# Altium schematic sheet SolBout.SchDoc: Soldeerbout Out
size A4; DrawnBy: Mangelschots Emiel; SheetNumber: 3; SheetTotal: 5; Parameter 1: /; Parameter 2: 1EAID 12302093
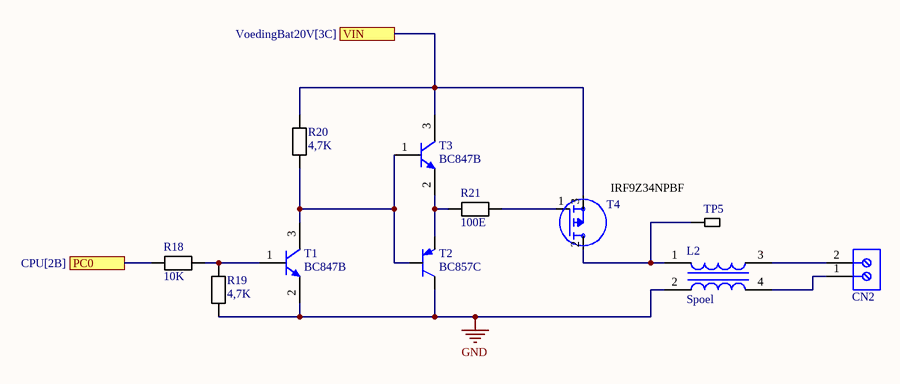
[diagram p0: SolBout.SchDoc]

## Parts
CN2  1725656  [2 pinHeader]  (value not drawn)
L2  Spoel  [Spoel]
R18  10K  [REST]
R19  4,7K  [REST]
R20  4,7K  [REST]
R21  100E  [REST]
T1  BC847B  [TRANS]
T2  BC857C  [SOT95P240X120-3N]
T3  BC847B  [TRANS]
T4  MOSFET  [TO254P1041X444X1930-3]  (value not drawn)
TP5  TP  [TP]  (value not drawn)

## Ports
PC0 (see CPU[2B]), VIN (see VoedingBat20V[3C])

## Nets
GND: L2.2 R19.1 T1.2(E) T2.3(C)
PC0: R18.1 ; port PC0
VIN: R20.2 T3.3(C) T4.3(S) ; port VIN
NetCN2_1: CN2.1 L2.4
NetCN2_2: CN2.2 L2.3
NetL2_1: L2.1 T4.2(D) TP5.1
NetR18_2: R18.2 R19.2 T1.1(B)
NetR20_1: R20.1 T1.3(C) T2.1(B) T3.1(B)
NetR21_1: R21.1 T2.2(E) T3.2(E)
NetR21_2: R21.2 T4.1(G)

## Notes on the sheet
- IRF9Z34NPBF

## Library data of the parts
CN2 = 2Pin-Header: Manufacturer: Phoenix Contact; Number of contacts: 2; Content: 250pc(s); Pitch: 2.54mm; Industrial packaging: Yes; Colour: Green; Manufacturer part No.: 1725656; Type: MPT0,5/2-2,54; Datasheet URL: http://datasheet.octopart.com/1725656-Phoenix-Contact-datasheet-5302866.pdf; Manufacturer URL: http://www.phoenixcontact.com/; Datasheet Version: Apr-08
L2 = Spoel: 2 Line Common Mode Choke Through Hole 170 Ohms @ 100 MHz 10A DCR 10mOhm CM2545X171B-10; MF: Laird; Value: *; Purchase-URL: https://pricing.snapeda.com/search/part/CM2545X171B-10/?ref=eda; Price: None; Package: Vertical-4 Laird; SnapEDA_Link: https://www.snapeda.com/parts/CM2545X171B-10/Laird/view-part/?ref=snap; Availability: In Stock; Check_prices: https://www.snapeda.com/parts/CM2545X171B-10/Laird/view-part/?ref=eda; MP: CM2545X171B-10
R18-R21 = resistor: Manufacturer: Vishay Dale; Part Number: CRCW08050000Z0EA
T1 T3 = Transistor: Manufacturer: On Semiconductor; PartNumber: BC547C; IC Continuous (A): 0.1; fT Min (MHz): 150; Packing: Bulk Box; Polarity: NPN; Mounting Technology: Through Hole; ComponentLink1URL: http://www.onsemi.com/; ComponentLink1Description: Manufacturer URL; ComponentLink3URL: http://www.onsemi.cn/pub_link/Collateral/2N6426-D.PDF; DatasheetVersion: Rev. 7; PackageVersion: Rev. AM; RoHS: FALSE; ComponentLink2URL: http://www.onsemi.com/pub_link/Collateral/BC546-D.PDF; ComponentLink3Description: Package Specification; PackageDescription: 3-Pin Transistor Outline, Body 4.825 x 3.685 mm, Pitch 1.27 mm; PackageReference: TO-92-3-29-11_AM_SL; ComponentLink2Description: Datasheet
T2 = BC857B: BJT, SOT-23, 45V, 100mA, PNP, 0.25W, 150C; MF: Diotec; SnapEDA_Link: https://www.snapeda.com/parts/BC857B/Diotec/view-part/?ref=snap; Package: SOT-23-3 Diotec; Value: *; MP: BC857B; Check_prices: https://www.snapeda.com/parts/BC857B/Diotec/view-part/?ref=eda
T4 = MOSFET: P-Channel 60V 18A _Tc_ 3.7W _Ta_, 88W _Tc_ Surface Mount D2PAK IRF9Z34SPBF; MF: Vishay; SnapEDA_Link: https://www.snapeda.com/parts/IRF9Z34SPBF/Vishay%20Siliconix/view-part/390212/?ref=snap; Price: None; MP: IRF9Z34SPBF; Value: *; Availability: Unavailable; Package: D2PAK Vishay
TP5 = TP: Part Number: GRM1885C1H100JA01D; Manufacturer: Murata